# Altium schematic sheet MCU.SchDoc
size A4
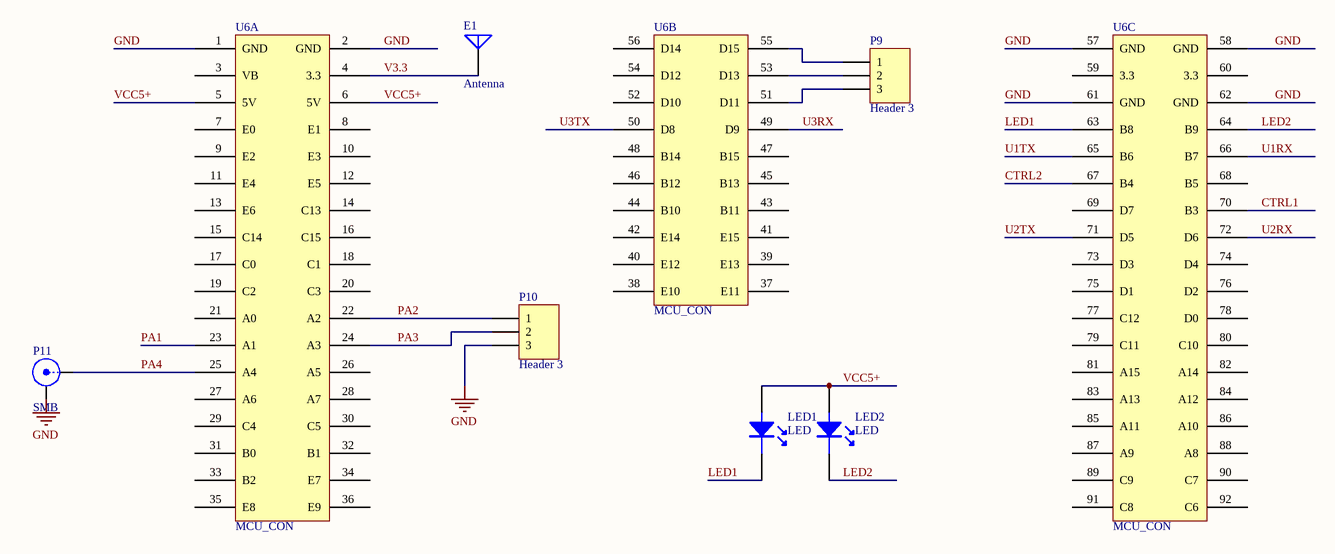
[diagram p0: MCU.SchDoc]

## Parts
E1  Antenna  [PIN1]
LED1  LED  [0805_LED]
LED2  LED  [0805_LED]
P9  Header 3  [HDR1X3]
P10  Header 3  [HDR1X3]
P11  SMB  [SMB_V-RJ45]
U6  MCU_CON  [MCU_CON]  (parts A,B,C of 3)

## Nets
GND: P10.3 P11.2(Y) U6.1(GND) U6.2(GND) U6.57(GND) U6.58(GND) U6.61(GND) U6.62(GND)
CTRL1: U6.70(B3)
CTRL2: U6.67(B4)
LED1: LED1.2(K) U6.63(B8)
LED2: LED2.2(K) U6.64(B9)
PA1: U6.23(A1)
PA2: P10.1 U6.22(A2)
PA3: P10.2 U6.24(A3)
PA4: P11.1(X) U6.25(A4)
U1RX: U6.66(B7)
U1TX: U6.65(B6)
U2RX: U6.72(D6)
U2TX: U6.71(D5)
U3RX: U6.49(D9)
U3TX: U6.50(D8)
V3.3: E1.1(A) U6.4(3.3)
VCC5+: LED1.1(A) LED2.1(A) U6.5(5V) U6.6(5V)
NetP9_1: P9.1 U6.55(D15)
NetP9_2: P9.2 U6.53(D13)
NetP9_3: P9.3 U6.51(D11)

Not connected (* = marked no-connect by the designer): U6 3(VB) 7(E0) 8(E1) 9(E2) 10(E3) 11(E4) 12(E5) 13(E6) 14(C13) 15(C14) 16(C15) 17(C0) 18(C1) 19(C2) 20(C3) 21(A0) 26(A5) 27(A6) 28(A7) 29(C4) 30(C5) 31(B0) 32(B1) 33(B2) 34(E7) 35(E8) 36(E9) 37(E11) 38(E10) 39(E13) 40(E12) 41(E15) 42(E14) 43(B11) 44(B10) 45(B13) 46(B12) 47(B15) 48(B14) 52(D10) 54(D12) 56(D14) 59(3.3) 60(3.3) 68(B5) 69(D7) 73(D3) 74(D4) 75(D1) 76(D2) 77(C12) 78(D0) 79(C11) 80(C10) 81(A15) 82(A14) 83(A13) 84(A12) 85(A11) 86(A10) 87(A9) 88(A8) 89(C9) 90(C7) 91(C8) 92(C6)

## Library data of the parts
E1 = Antenna: Generic Antenna; Published: 24-Mar-1999; LatestRevisionDate: 17-Jul-2002; LatestRevisionNote: Re-released for DXP Platform.; PackageReference: PIN1; Publisher: Altium Limited
P9 P10 = Header 3: Header, 3-Pin; LatestRevisionDate: 17-Jul-2002; LatestRevisionNote: Re-released for DXP Platform.; Publisher: Altium Limited
P11 = SMB: SMB Straight Connector; LatestRevisionDate: 17-Jul-2002; LatestRevisionNote: Re-released for DXP Platform.; Publisher: Altium Limited